# Altium schematic sheet OutputPort.SchDoc
size A4
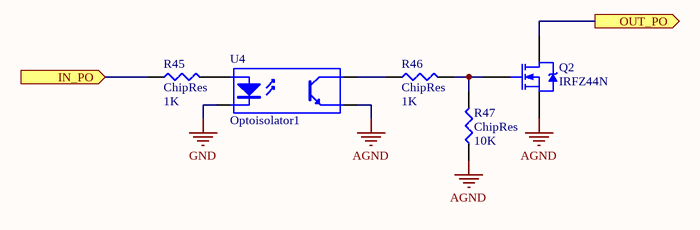
[diagram p0: OutputPort.SchDoc]

## Parts
Q2  IRFZ44N  [TO-220AB]
R45  ChipRes  value 1K  [RES0805]
R46  ChipRes  value 1K  [RES0805]
R47  ChipRes  value 10K  [RES0805]
U4  Optoisolator1  [DIP-4]

## Ports
IN_PO (in), OUT_PO (out)

## Nets
AGND: Q2.3(S) R47.1 U4.3(E)
GND: U4.2(K)
IN_PO: R45.1 ; port IN_PO
OUT_PO: Q2.2(D) ; port OUT_PO
NetQ2_1: Q2.1(G) R46.2 R47.2
NetR45_2: R45.2 U4.1(A)
NetR46_1: R46.1 U4.4(C)

## Library data of the parts
Q2 = IRFZ44N: HEXFET Power MOSFET; Note: Pin 2 is electrically connected to pin 4.; Published: 8-Jun-2000; LatestRevisionDate: 17-Jul-2002; LatestRevisionNote: Re-released for DXP Platform.; DatasheetVersion: Aug-1997; PackageVersion: Feb-1997; PackageReference: TO-220AB; Publisher: Altium Limited; PackageDescription: TO, Thru-Hole, Vertical, Heatsink Mounted; 3 In-Line Leads; Pitch 2.54 mm; ComponentLink1Description: Manufacturer Link; ComponentLink1URL: http://www.irf.com/; ComponentLink2Description: Datasheet; ComponentLink2URL: http://www.irf.com/product-info/datasheets/data/irfz44n.pdf
R45-R47 = ChipRes: Chip resistor
U4 = Optoisolator1: 4-Pin Phototransistor Optocoupler; Published: 24-Mar-1999; LatestRevisionDate: 04-Mar-2005; LatestRevisionNote: Sch pins 3 & 4 Swapped.; DatasheetVersion: Nov-2003; PackageReference: DIP-4; Publisher: Altium Limited